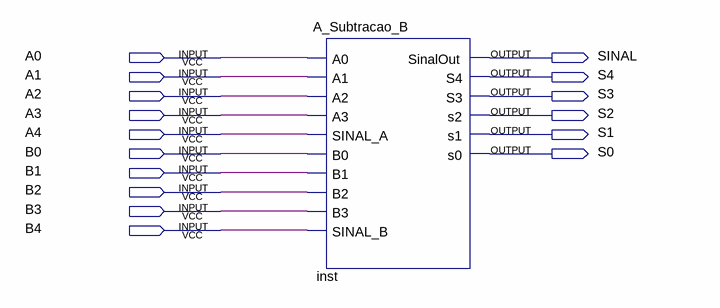
[diagram p0: schematic sheet]
// Quartus schematic Teste.bdf as structural Verilog: 1 symbols, 16 pins
module Teste (
  input  A0,
  input  A1,
  input  A2,
  input  A3,
  input  A4,
  input  B0,
  input  B1,
  input  B2,
  input  B3,
  input  B4,
  output SINAL,
  output S4,
  output S3,
  output S2,
  output S1,
  output S0
);

  A_Subtracao_B inst (
    .A0(A0), .A1(A1), .A2(A2), .A3(A3), .SINAL_A(A4), .B0(B0), .B1(B1), .B2(B2), .B3(B3), .SINAL_B(B4),
    .SinalOut(SINAL), .S4(S4), .S3(S3), .s2(S2), .s1(S1), .s0(S0));
endmodule
